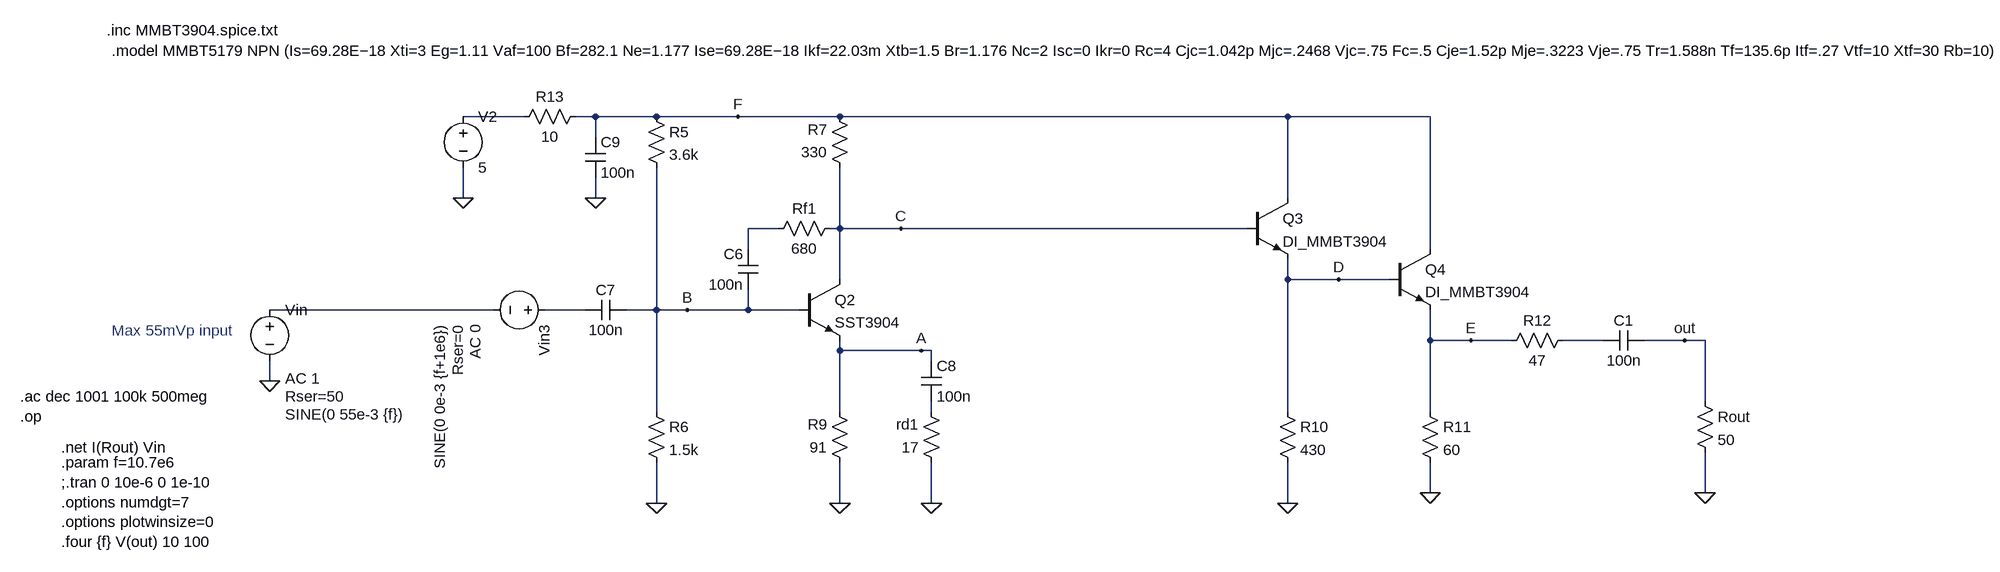
[diagram p0: schematic TIA3_5V_2mA.asc]
TIA3_5V_2mA.asc, the LTspice schematic file:
Version 4
SHEET 1 4604 680
WIRE 2000 -128 1904 -128
WIRE 2112 -128 2080 -128
WIRE 2208 -128 2112 -128
WIRE 2336 -128 2208 -128
WIRE 2496 -128 2336 -128
WIRE 3200 -128 2496 -128
WIRE 3424 -128 3200 -128
WIRE 2112 -96 2112 -128
WIRE 1904 0 1904 -48
WIRE 2112 0 2112 -32
WIRE 3200 0 3200 -128
WIRE 2400 48 2352 48
WIRE 2496 48 2496 -48
WIRE 2496 48 2480 48
WIRE 2592 48 2496 48
WIRE 3136 48 2592 48
WIRE 2352 80 2352 48
WIRE 3424 80 3424 -128
WIRE 2496 128 2496 48
WIRE 3200 128 3200 96
WIRE 3280 128 3200 128
WIRE 3360 128 3280 128
WIRE 1952 176 1600 176
WIRE 2096 176 2032 176
WIRE 2208 176 2208 -48
WIRE 2208 176 2160 176
WIRE 2256 176 2208 176
WIRE 2352 176 2352 144
WIRE 2352 176 2256 176
WIRE 2432 176 2352 176
WIRE 3424 224 3424 176
WIRE 3488 224 3424 224
WIRE 3552 224 3488 224
WIRE 3696 224 3632 224
WIRE 3824 224 3760 224
WIRE 3856 224 3824 224
WIRE 2496 240 2496 224
WIRE 2624 240 2496 240
WIRE 2640 240 2624 240
WIRE 2640 256 2640 240
WIRE 1600 288 1600 256
WIRE 3856 320 3856 224
WIRE 2208 336 2208 176
WIRE 2496 336 2496 240
WIRE 2640 336 2640 320
WIRE 3200 336 3200 128
WIRE 3424 336 3424 224
WIRE 3424 464 3424 416
WIRE 3856 464 3856 400
WIRE 2208 480 2208 416
WIRE 2496 480 2496 416
WIRE 2640 480 2640 416
WIRE 3200 480 3200 416
FLAG 2208 480 0
FLAG 2496 480 0
FLAG 2640 480 0
FLAG 3200 480 0
FLAG 3424 464 0
FLAG 3856 464 0
FLAG 1904 0 0
FLAG 1600 288 0
FLAG 2112 0 0
FLAG 2624 240 A
FLAG 2256 176 B
FLAG 2592 48 C
FLAG 3280 128 D
FLAG 3488 224 E
FLAG 2336 -128 F
FLAG 3824 224 out
SYMBOL npn 2432 128 R0
SYMATTR InstName Q2
SYMATTR Value SST3904
SYMBOL res 2192 -144 R0
SYMATTR InstName R5
SYMATTR Value 3.6k
SYMBOL res 2192 320 R0
SYMATTR InstName R6
SYMATTR Value 1.5k
SYMBOL res 2496 32 R90
WINDOW 0 0 56 VBottom 2
WINDOW 3 32 56 VTop 2
SYMATTR InstName Rf1
SYMATTR Value 680
SYMBOL res 2512 -32 R180
WINDOW 0 36 76 Left 2
WINDOW 3 36 40 Left 2
SYMATTR InstName R7
SYMATTR Value 330
SYMBOL res 2512 432 R180
WINDOW 0 36 76 Left 2
WINDOW 3 36 40 Left 2
SYMATTR InstName R9
SYMATTR Value 91
SYMBOL res 2656 432 R180
WINDOW 0 36 76 Left 2
WINDOW 3 36 40 Left 2
SYMATTR InstName rd1
SYMATTR Value 17
SYMBOL npn 3136 0 R0
SYMATTR InstName Q3
SYMATTR Value DI_MMBT3904
SYMBOL npn 3360 80 R0
SYMATTR InstName Q4
SYMATTR Value DI_MMBT3904
SYMBOL res 3184 320 R0
SYMATTR InstName R10
SYMATTR Value 430
SYMBOL res 3408 320 R0
SYMATTR InstName R11
SYMATTR Value 60
SYMBOL res 3648 208 R90
WINDOW 0 0 56 VBottom 2
WINDOW 3 32 56 VTop 2
SYMATTR InstName R12
SYMATTR Value 47
SYMBOL cap 3760 208 R90
WINDOW 0 0 32 VBottom 2
WINDOW 3 32 32 VTop 2
SYMATTR InstName C1
SYMATTR Value 100n
SYMBOL cap 2368 144 R180
WINDOW 0 24 56 Left 2
WINDOW 3 24 8 Left 2
SYMATTR InstName C6
SYMATTR Value 100n
SYMBOL cap 2096 192 R270
WINDOW 0 32 32 VTop 2
WINDOW 3 0 32 VBottom 2
SYMATTR InstName C7
SYMATTR Value 100n
SYMBOL res 3840 304 R0
SYMATTR InstName Rout
SYMATTR Value 50
SYMBOL voltage 1904 -144 R0
WINDOW 123 0 0 Left 0
WINDOW 39 0 0 Left 0
SYMATTR InstName V2
SYMATTR Value 5
SYMBOL voltage 1600 160 R0
WINDOW 3 24 180 Left 2
WINDOW 123 24 124 Left 2
WINDOW 39 24 152 Left 2
SYMATTR Value SINE(0 55e-3 {f})
SYMATTR Value2 AC 1
SYMATTR SpiceLine Rser=50
SYMATTR InstName Vin
SYMBOL cap 2624 256 R0
SYMATTR InstName C8
SYMATTR Value 100n
SYMBOL res 2096 -144 R90
WINDOW 0 0 56 VBottom 2
WINDOW 3 32 56 VTop 2
SYMATTR InstName R13
SYMATTR Value 10
SYMBOL cap 2096 -96 R0
SYMATTR InstName C9
SYMATTR Value 100n
SYMBOL voltage 2048 176 R90
WINDOW 3 24 180 Left 2
WINDOW 123 24 124 Left 2
WINDOW 39 24 152 Left 2
SYMATTR Value SINE(0 0e-3 {f+1e6})
SYMATTR Value2 AC 0
SYMATTR SpiceLine Rser=0
SYMATTR InstName Vin3
TEXT 1344 -264 Left 2 !.inc MMBT3904.spice.txt
TEXT 1272 392 Left 2 !.net I(Rout) Vin
TEXT 1208 312 Left 2 !.ac dec 1001 100k 500meg\n.op
TEXT 1272 416 Left 2 !.param f=10.7e6\n;.tran 0 10e-6 0 1e-10\n.options numdgt=7\n.options plotwinsize=0\n.four {f} V(out) 10 100
TEXT 1352 208 Left 2 ;Max 55mVp input
TEXT 1352 -232 Left 2 !.model MMBT5179 NPN (Is=69.28E−18 Xti=3 Eg=1.11 Vaf=100 Bf=282.1 Ne=1.177 Ise=69.28E−18 Ikf=22.03m Xtb=1.5 Br=1.176 Nc=2 Isc=0 Ikr=0 Rc=4 Cjc=1.042p Mjc=.2468 Vjc=.75 Fc=.5 Cje=1.52p Mje=.3223 Vje=.75 Tr=1.588n Tf=135.6p Itf=.27 Vtf=10 Xtf=30 Rb=10)

The netlist it stands for:
* TIA3_5V_2mA.asc
Q2 C B A 0 SST3904
R5 F B 3.6k
R6 B 0 1.5k
Rf1 C N002 680
R7 C F 330
R9 0 A 91
rd1 0 N006 17
Q3 F C D 0 DI_MMBT3904
Q4 F D E 0 DI_MMBT3904
R10 D 0 430
R11 E 0 60
R12 N005 E 47
C1 out N005 100n
C6 B N002 100n
C7 N004 B 100n
Rout out 0 50
V2 N001 0 5
Vin N003 0 SINE(0 55e-3 {f}) AC 1 Rser=50
C8 A N006 100n
R13 F N001 10
C9 F 0 100n
Vin3 N004 N003 SINE(0 0e-3 {f+1e6}) AC 0 Rser=0
.model NPN NPN
.model PNP PNP
.lib standard.bjt
.inc MMBT3904.spice.txt
.net I(Rout) Vin
.ac dec 1001 100k 500meg
.op
.param f=10.7e6
;.tran 0 10e-6 0 1e-10
.options numdgt=7
.options plotwinsize=0
.four {f} V(out) 10 100
* Max 55mVp input
.model MMBT5179 NPN (Is=69.28E−18 Xti=3 Eg=1.11 Vaf=100 Bf=282.1 Ne=1.177 Ise=69.28E−18 Ikf=22.03m Xtb=1.5 Br=1.176 Nc=2 Isc=0 Ikr=0 Rc=4 Cjc=1.042p Mjc=.2468 Vjc=.75 Fc=.5 Cje=1.52p Mje=.3223 Vje=.75 Tr=1.588n Tf=135.6p Itf=.27 Vtf=10 Xtf=30 Rb=10)
.backanno
.end